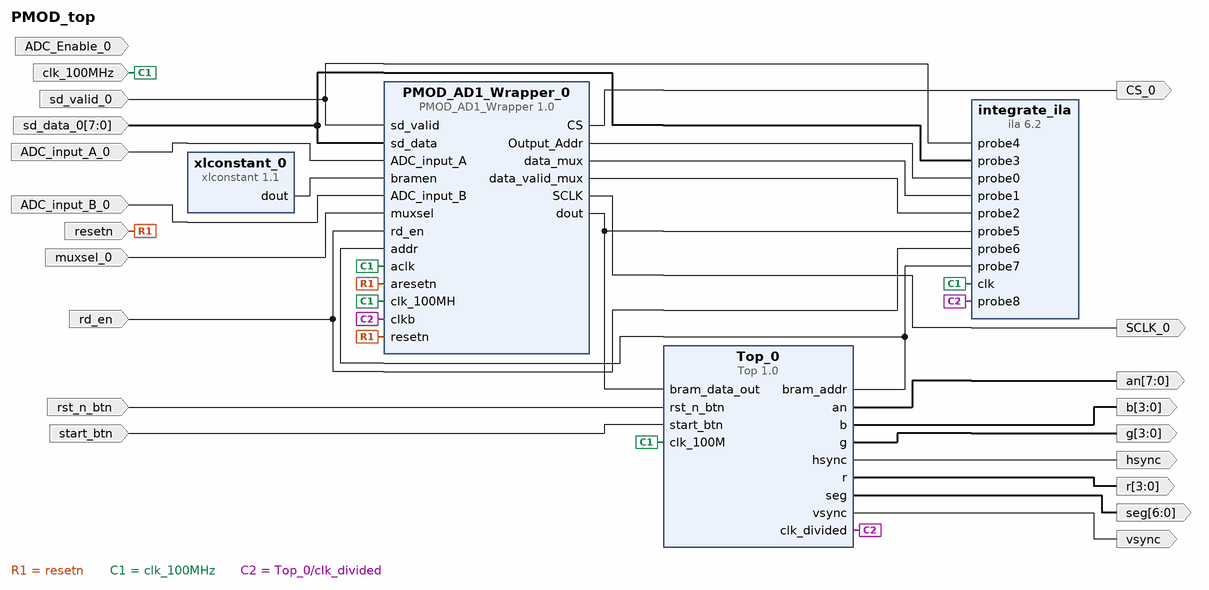
[diagram p0: block diagram of the top level]
# Vivado block design PMOD_top, xc7a100tcsg324-1, Vivado 2018.3
create_bd_design PMOD_top

create_bd_port -dir I resetn
create_bd_port -dir I -type clk clk_100MHz
set_property -dict {CONFIG.FREQ_HZ 100000000} [get_bd_ports clk_100MHz]
create_bd_port -dir I ADC_input_A_0
create_bd_port -dir I ADC_input_B_0
create_bd_port -dir O CS_0
create_bd_port -dir O SCLK_0
create_bd_port -dir I ADC_Enable_0
create_bd_port -dir I sd_valid_0
create_bd_port -dir I -from 7 -to 0 sd_data_0
create_bd_port -dir I muxsel_0
create_bd_port -dir I rd_en
create_bd_port -dir O -from 7 -to 0 an
create_bd_port -dir O -from 3 -to 0 b
create_bd_port -dir O -from 3 -to 0 g
create_bd_port -dir O hsync
create_bd_port -dir O -from 3 -to 0 r
create_bd_port -dir I rst_n_btn
create_bd_port -dir O -from 6 -to 0 seg
create_bd_port -dir I start_btn
create_bd_port -dir O vsync

create_bd_cell -type ip -vlnv xilinx.com:ip:ila:6.2 integrate_ila
set_property -dict [list \
  CONFIG.C_DATA_DEPTH 8192 \
  CONFIG.C_ENABLE_ILA_AXI_MON false \
  CONFIG.C_MONITOR_TYPE Native \
  CONFIG.C_NUM_OF_PROBES 9 \
  CONFIG.C_PROBE0_WIDTH 32 \
  CONFIG.C_PROBE1_WIDTH 32 \
  CONFIG.C_PROBE3_WIDTH 8 \
  CONFIG.C_PROBE5_WIDTH 32 \
  CONFIG.C_PROBE7_WIDTH 16 \
] [get_bd_cells integrate_ila]
create_bd_cell -type ip -vlnv xilinx.com:ip:xlconstant:1.1 xlconstant_0
create_bd_cell -type ip -vlnv xilinx.com:user:PMOD_AD1_Wrapper:1.0 PMOD_AD1_Wrapper_0
set_property -dict {CONFIG.BRAM_MAX_ADDR 0xffffffff} [get_bd_cells PMOD_AD1_Wrapper_0]
create_bd_cell -type ip -vlnv xilinx.com:user:Top:1.0 Top_0

# ---- connections ----

connect_bd_net [get_bd_ports resetn] [get_bd_pins PMOD_AD1_Wrapper_0/resetn] [get_bd_pins PMOD_AD1_Wrapper_0/aresetn]
connect_bd_net -net ADC_input_A_0_1 [get_bd_ports ADC_input_A_0] [get_bd_pins PMOD_AD1_Wrapper_0/ADC_input_A]
connect_bd_net -net ADC_input_B_0_1 [get_bd_ports ADC_input_B_0] [get_bd_pins PMOD_AD1_Wrapper_0/ADC_input_B]
connect_bd_net [get_bd_pins PMOD_AD1_Wrapper_0/CS] [get_bd_ports CS_0]
connect_bd_net [get_bd_pins PMOD_AD1_Wrapper_0/SCLK] [get_bd_ports SCLK_0]
connect_bd_net -net clk_wiz_clk_out2 [get_bd_ports clk_100MHz] \
  [get_bd_pins integrate_ila/clk] [get_bd_pins PMOD_AD1_Wrapper_0/clk_100MH] [get_bd_pins PMOD_AD1_Wrapper_0/aclk] \
  [get_bd_pins Top_0/clk_100M]
connect_bd_net -net sd_valid_0_1 [get_bd_ports sd_valid_0] [get_bd_pins integrate_ila/probe4] [get_bd_pins PMOD_AD1_Wrapper_0/sd_valid]
connect_bd_net -net sd_data_0_1 [get_bd_ports sd_data_0] [get_bd_pins integrate_ila/probe3] [get_bd_pins PMOD_AD1_Wrapper_0/sd_data]
connect_bd_net -net muxsel_0_1 [get_bd_ports muxsel_0] [get_bd_pins PMOD_AD1_Wrapper_0/muxsel]
connect_bd_net -net rd_en_0_1 [get_bd_ports rd_en] [get_bd_pins integrate_ila/probe6] [get_bd_pins PMOD_AD1_Wrapper_0/rd_en]
connect_bd_net [get_bd_pins PMOD_AD1_Wrapper_0/Output_Addr] [get_bd_pins integrate_ila/probe0]
connect_bd_net [get_bd_pins PMOD_AD1_Wrapper_0/data_mux] [get_bd_pins integrate_ila/probe1]
connect_bd_net [get_bd_pins PMOD_AD1_Wrapper_0/data_valid_mux] [get_bd_pins integrate_ila/probe2]
connect_bd_net [get_bd_pins PMOD_AD1_Wrapper_0/dout] [get_bd_pins integrate_ila/probe5] [get_bd_pins Top_0/bram_data_out]
connect_bd_net [get_bd_pins Top_0/an] [get_bd_ports an]
connect_bd_net [get_bd_pins Top_0/b] [get_bd_ports b]
connect_bd_net [get_bd_pins Top_0/g] [get_bd_ports g]
connect_bd_net [get_bd_pins Top_0/hsync] [get_bd_ports hsync]
connect_bd_net [get_bd_pins Top_0/r] [get_bd_ports r]
connect_bd_net -net rst_n_btn_0_1 [get_bd_ports rst_n_btn] [get_bd_pins Top_0/rst_n_btn]
connect_bd_net [get_bd_pins Top_0/seg] [get_bd_ports seg]
connect_bd_net -net start_btn_0_1 [get_bd_ports start_btn] [get_bd_pins Top_0/start_btn]
connect_bd_net [get_bd_pins Top_0/vsync] [get_bd_ports vsync]
connect_bd_net [get_bd_pins Top_0/clk_divided] [get_bd_pins integrate_ila/probe8] [get_bd_pins PMOD_AD1_Wrapper_0/clkb]
connect_bd_net [get_bd_pins Top_0/bram_addr] [get_bd_pins integrate_ila/probe7] [get_bd_pins PMOD_AD1_Wrapper_0/addr]
connect_bd_net [get_bd_pins xlconstant_0/dout] [get_bd_pins PMOD_AD1_Wrapper_0/bramen]

validate_bd_design
save_bd_design
